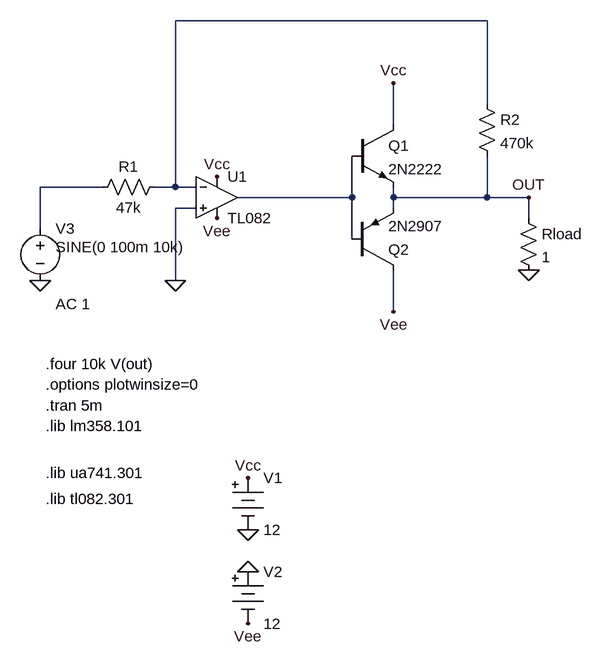
[diagram p0: schematic ex8_ampl.asc]
ex8_ampl.asc, the LTspice schematic file:
Version 4
SHEET 1 1604 908
WIRE 784 -112 304 -112
WIRE 784 16 784 -112
WIRE 640 48 640 -16
WIRE 192 144 96 144
WIRE 304 144 304 -112
WIRE 304 144 272 144
WIRE 336 144 304 144
WIRE 576 160 576 96
WIRE 576 160 400 160
WIRE 640 160 640 144
WIRE 784 160 784 96
WIRE 784 160 640 160
WIRE 848 160 784 160
WIRE 336 176 304 176
WIRE 640 176 640 160
WIRE 848 192 848 160
WIRE 96 208 96 144
WIRE 576 224 576 160
WIRE 304 288 304 176
WIRE 640 336 640 272
FLAG 416 736 0
FLAG 416 672 0
FLAG 416 592 Vcc
FLAG 416 816 Vee
FLAG 368 128 Vcc
FLAG 368 192 Vee
FLAG 304 288 0
FLAG 96 288 0
FLAG 640 336 Vee
FLAG 640 -16 Vcc
FLAG 848 272 0
FLAG 848 160 OUT
SYMBOL Misc\\battery 416 576 R0
SYMATTR InstName V1
SYMATTR Value 12
SYMBOL Misc\\battery 416 720 R0
SYMATTR InstName V2
SYMATTR Value 12
SYMBOL Opamps\\opamp2 368 96 R0
SYMATTR InstName U1
SYMATTR Value TL082
SYMBOL voltage 96 192 R0
WINDOW 123 24 132 Left 2
WINDOW 39 0 0 Left 2
WINDOW 3 24 44 Left 2
SYMATTR Value2 AC 1
SYMATTR Value SINE(0 100m 10k)
SYMATTR InstName V3
SYMBOL res 288 128 R90
WINDOW 0 0 56 VBottom 2
WINDOW 3 32 56 VTop 2
SYMATTR InstName R1
SYMATTR Value 47k
SYMBOL npn 576 48 R0
SYMATTR InstName Q1
SYMATTR Value 2N2222
SYMBOL pnp 576 272 M180
SYMATTR InstName Q2
SYMATTR Value 2N2907
SYMBOL res 768 0 R0
SYMATTR InstName R2
SYMATTR Value 470k
SYMBOL res 832 176 R0
SYMATTR InstName Rload
SYMATTR Value 1
TEXT 104 512 Left 2 !.lib lm358.101
TEXT 104 480 Left 2 !.tran 5m
TEXT 104 448 Left 2 !.options plotwinsize=0
TEXT 104 416 Left 2 !.four 10k V(out)
TEXT 104 584 Left 2 !.lib ua741.301
TEXT 104 624 Left 2 !.lib tl082.301

The netlist it stands for:
* ex8_ampl.asc
V1 Vcc 0 12
V2 0 Vee 12
XU1 0 N001 Vcc Vee N003 TL082  ; pins In+ In- V+ V- OUT
V3 N002 0 SINE(0 100m 10k) AC 1
R1 N001 N002 47k
Q1 Vcc N003 OUT 0 2N2222
Q2 Vee N003 OUT 0 2N2907
R2 N001 OUT 470k
Rload OUT 0 1
.model NPN NPN
.model PNP PNP
.lib standard.bjt
.lib lm358.101
.tran 5m
.options plotwinsize=0
.four 10k V(out)
.lib ua741.301
.lib tl082.301
.backanno
.end